# EAGLE design ObdBackplane (EAGLE 7.7.0)
ODB II WIFI Backplane
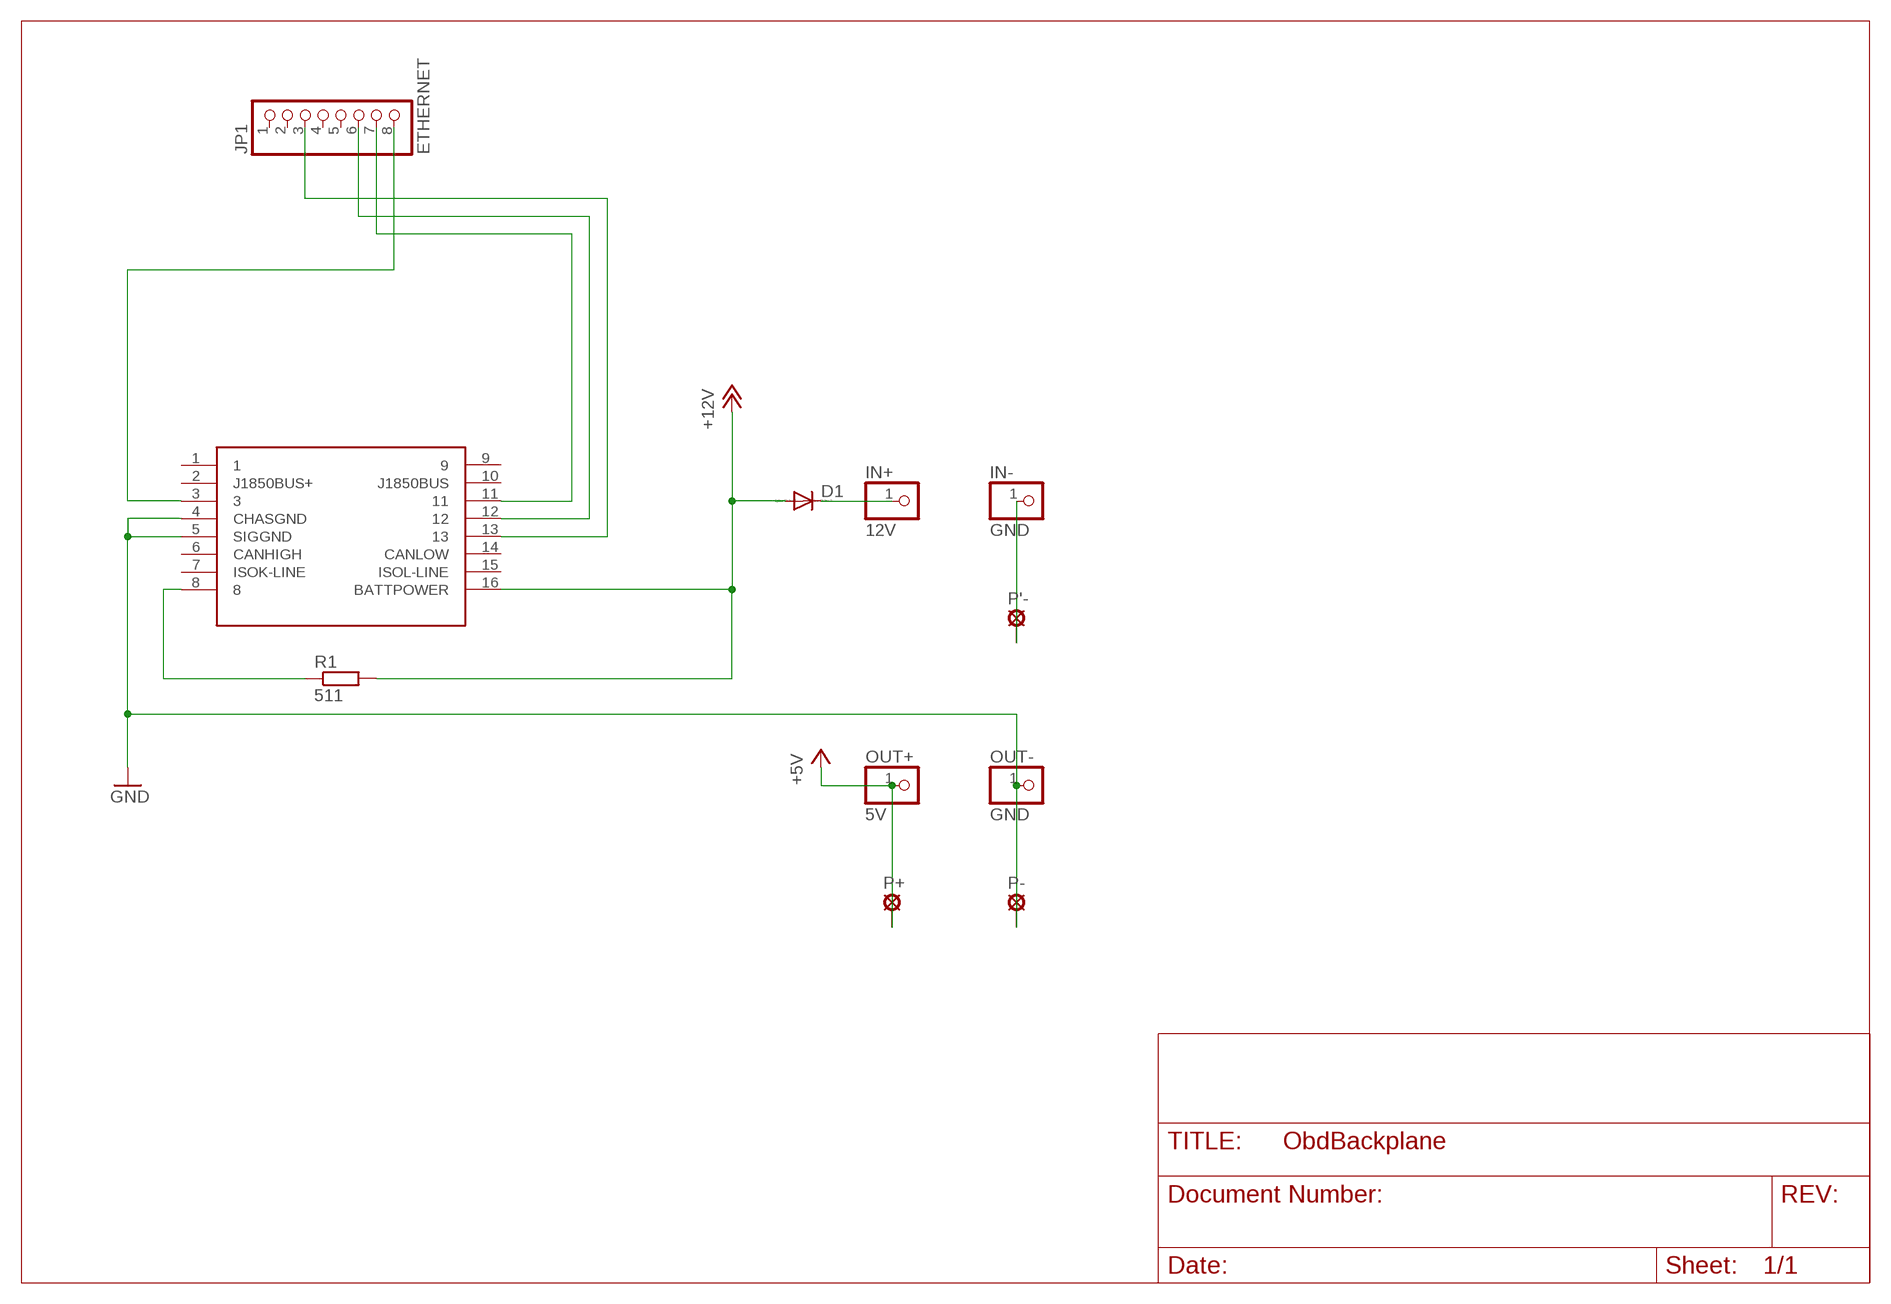
[diagram p0: schematic, sheet 1]

## Parts
D1  DIODE-DO214AC  [DO214AC]
IN+  12V  PINHD-1X1  [1X01]
IN-  GND  PINHD-1X1  [1X01]
JP1  ETHERNET  PINHD-1X8_1.00  [1X08M-1MM]
OBDII  OBDII  [OBDII]
OUT+  5V  PINHD-1X1  [1X01]
OUT-  GND  PINHD-1X1  [1X01]
P'-  SE14  [SE14]
P+  SE14  [SE14]
P-  SE14  [SE14]
R1  511  R-EU_R2512  [R2512]

## Nets
+5V: OUT+.1 P+.MP
+12V: D1.A OBDII.16(BATTPOWER) R1.2
GND: OBDII.4(CHASGND) OBDII.5(SIGGND) OUT-.1 P-.MP
GND2: IN-.1 P'-.MP
N$1: D1.C IN+.1
N$2: OBDII.8 R1.1
N$3: JP1.8 OBDII.3
N$4: JP1.6 OBDII.12
N$6: JP1.3 OBDII.13
N$7: JP1.7 OBDII.11
Unconnected: JP1.1 JP1.2 JP1.4 JP1.5 OBDII.1 OBDII.2(J1850BUS+) OBDII.6(CANHIGH) OBDII.7(ISOK-LINE) OBDII.9 OBDII.10(J1850BUS) OBDII.14(CANLOW) OBDII.15(ISOL-LINE)

## Library data of the parts
D1 = diode:DIODE-: DIODE
IN+ IN- OUT+ OUT- = pinhead:PINHD-1X1: PIN HEADER
JP1 = obd_special:PINHD-1X8: PIN HEADER
OBDII = SparkFun-Connectors:OBDII: OBD-II Connector OBDII is an on board diagnostics standard that is used on a large variety of cars. Here is the connector we sell at SparkFun: OBD-II connector <https://www.sparkfun.com/products/9911> (DEV-09911) Info and Pinout <http://pinoutsguide.com/CarElectronics/car_obd2_pinout.shtml> (sorry, no datasheet) We do not use this connector on any active designs, however, if you're looking for OBDII tech, please check out these: SparkFun OBD related products <https://www.sparkfun.com/search/results?term=obd>; SF_ID: DEV-09911
P'- P+ P- = solpad:SE14: SOLDER PAD E1553, drill 1,4mm, distributor Buerklin, 07F820
R1 = resistor:R-EU_: RESISTOR, European symbol

## Board
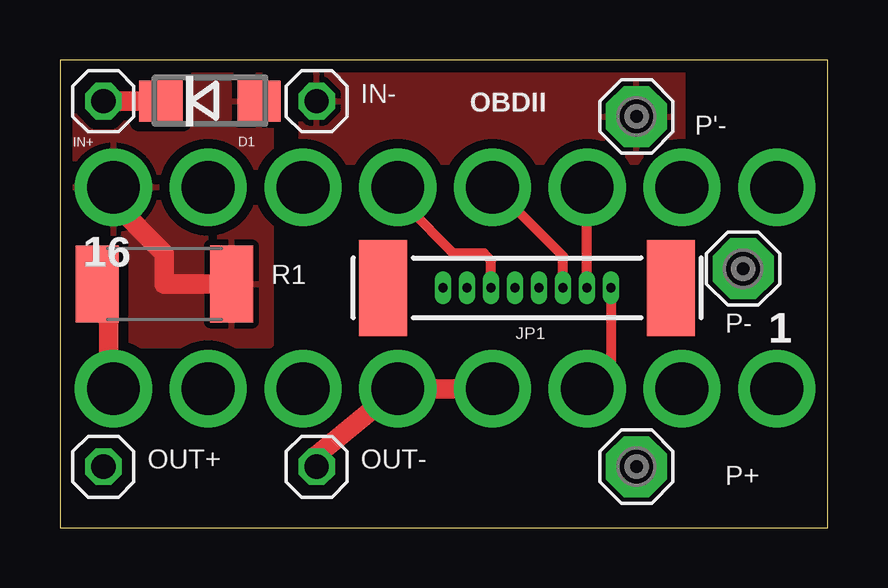
[diagram p1: board, top side]
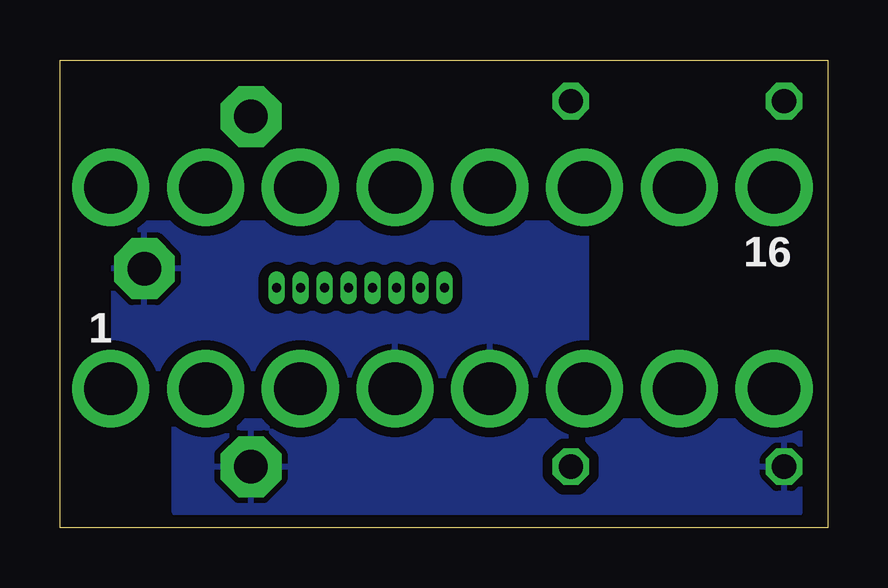
[diagram p2: board, bottom side, seen from below]

Size 32 x 19.5 mm. Coordinates in mm from the lower left corner, seen from the top.
Outline: 0,0 32,0 32,19.5 0,19.5 0,0
Copper layers (1*16): Top 0.035mm / dielectric 1.6mm / Bottom 0.035mm
Design rules "Elecrow_2-layer_PCB_eagle_rule": minimum track width 6mil, minimum drill 12mil, track to track 6mil, track to pad 8mil, pad to pad 12mil, via to via 12mil, smd to smd 0mil, copper to edge 20mil, drill to drill 10mil, minimum pad ring 6mil, minimum via ring 6mil, stop-mask expansion 0mil, vias tented up to drill 100mil, thermal gap 10mil

### Footprints (pad centres in the part's own frame; a part is rotated, then mirrored left to right if it is on the bottom)
DO214AC = smd 1.8 x 1.7: A 2.05,0; C -2.05,0
1X01 = drill 1.016 octagon: 1 0,0
1X08M-1MM = drill 0.381 long: 1 -3.5,0; 2 -2.5,0; 3 -1.5,0; 4 -0.5,0; 5 0.5,0; 6 1.5,0; 7 2.5,0; 8 3.5,0 | smd 2 x 4: PAD1 -6,0; PAD2 6,0
OBDII = drill 2.2: 1 13.68,-3.81; 2 9.73,-3.81; 3 5.78,-3.81; 4 1.83,-3.81; 5 -2.12,-3.81; 6 -6.07,-3.81; 7 -10.02,-3.81; 8 -13.97,-3.81; 9 13.68,4.59; 10 9.73,4.59; 11 5.78,4.59; 12 1.83,4.59; 13 -2.12,4.59; 14 -6.07,4.59; 15 -10.02,4.59; 16 -13.97,4.59
SE14 = drill 1.397 pad 2.54 octagon: MP 0,0
R2512 = smd 1.8 x 3.2: 1 -2.8,0; 2 2.8,0

### Placement (x,y rotation side)
D1  100V  [DO214AC]  6.26,17.78 0 top
IN+  1.81,17.78 0 top
IN-  10.7,17.78 0 top
JP1  19.47,10 0 top
OBDII  16.2,9.6 0 top
OUT+  1.81,2.54 0 top
OUT-  10.7,2.54 0 top
P'-  24.04,17.14 0 top
P+  24.04,2.54 0 top
P-  28.48,10.79 0 top
R1  4.35,10.16 0 top

### Tracks (layer width: path | path; a pad name or v marks a point on that pad's centre or on a via)
+5V
  pour Bottom (isolate 0.406): 1.17,0.64 27.21,0.64 27.21,4.45 1.17,4.45
+12V
  Top 0.813: OBDII.16 2.23,13.55 4.35,11.43 4.35,10.16 R1.2
  pour Top (isolate 0.406): 0.54,19.05 0.54,7.62 8.79,7.62 8.79,19.05
GND
  Top 0.813: OUT-.1 10.7,3.01 OBDII.5 OBDII.4
  pour Bottom (isolate 0.406): 29.75,6.35 29.75,12.7 10.06,12.7 10.06,6.35
GND2
  pour Top (isolate 0.406): 10.06,19.05 25.94,19.05 25.94,15.24 10.06,15.24
N$1
  Top 0.813: D1.C IN+.1
N$2
  Top 0.813: R1.1 2.03,10.16 2.03,5.99 OBDII.8
N$3
  Top 0.406: JP1.8 22.97,6.78 OBDII.3
N$4
  Top 0.406: JP1.6 20.97,11.32 18.32,13.97 18.25,13.97 OBDII.12
N$6
  Top 0.406: JP1.3 17.97,11.14 17.68,11.43 16.41,11.43 14.51,13.34 14.51,13.76 OBDII.13
N$7
  Top 0.406: JP1.7 OBDII.11